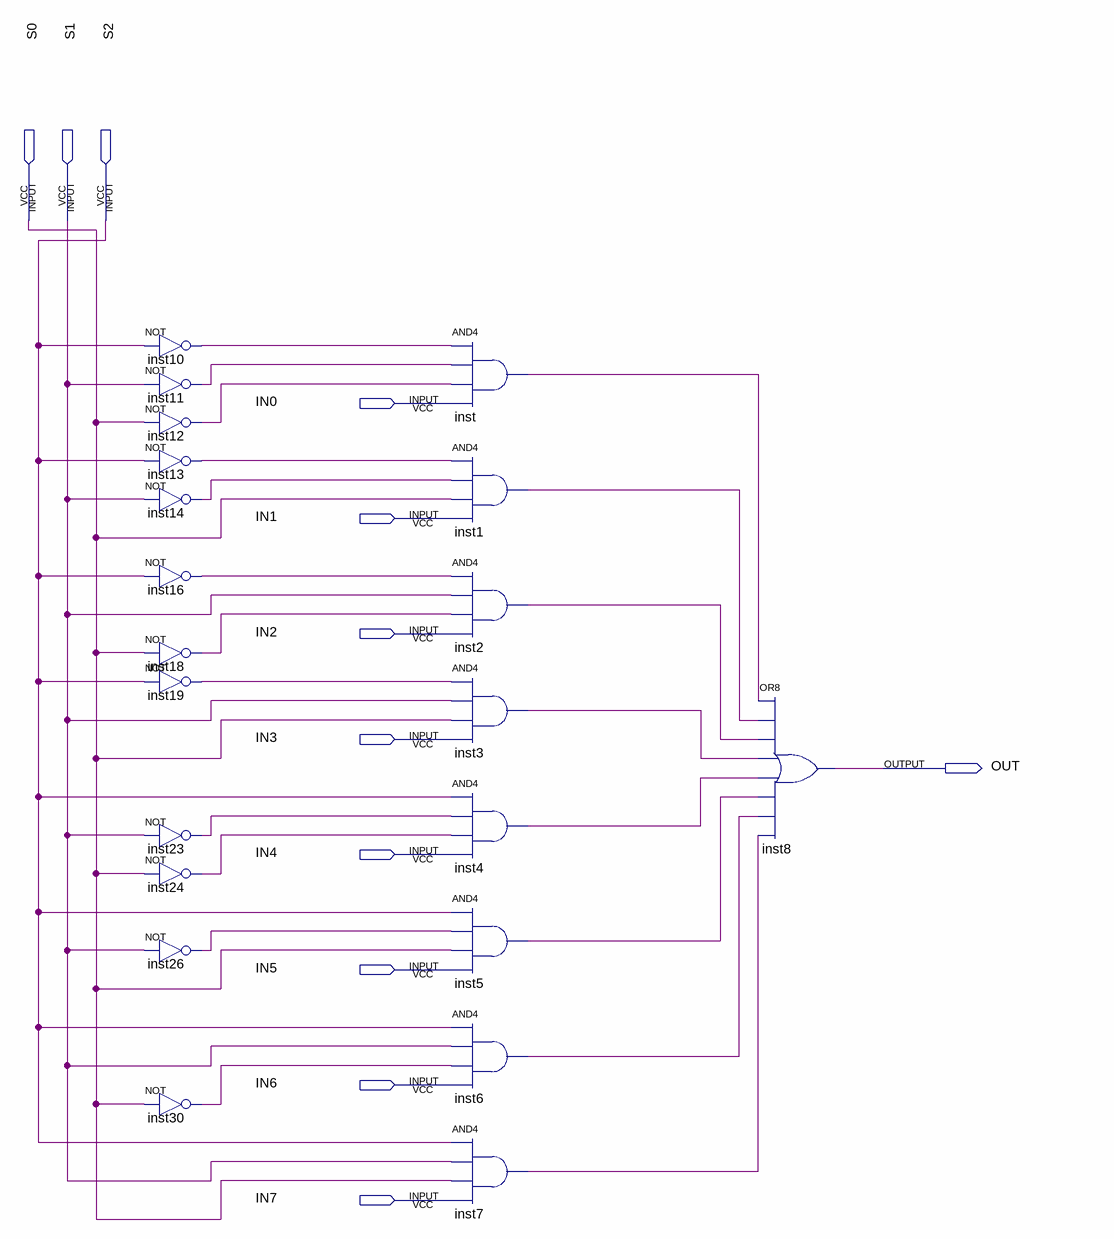
[diagram p0: schematic sheet]
// Quartus schematic MuxOitoPorUm.bdf as structural Verilog: 21 symbols, 12 pins
module MuxOitoPorUm (
  input  S0,
  input  S1,
  input  S2,
  input  IN0,
  input  IN1,
  input  IN2,
  input  IN3,
  input  IN4,
  input  IN5,
  input  IN6,
  input  IN7,
  output OUT
);

  wire inst1_out, inst2_out, inst3_out, inst4_out, inst5_out, inst6_out, inst7_out, inst10_out, inst11_out,
       inst12_out, inst13_out, inst14_out, inst16_out, inst18_out, inst19_out, inst23_out, inst24_out,
       inst26_out, inst30_out, inst_out;

  not inst10 (inst10_out, S2);
  not inst11 (inst11_out, S1);
  not inst12 (inst12_out, S0);
  not inst13 (inst13_out, S2);
  not inst14 (inst14_out, S1);
  not inst16 (inst16_out, S2);
  not inst18 (inst18_out, S0);
  not inst19 (inst19_out, S2);
  not inst23 (inst23_out, S1);
  not inst24 (inst24_out, S0);
  not inst26 (inst26_out, S1);
  not inst30 (inst30_out, S0);
  and inst (inst_out, inst10_out, inst11_out, inst12_out, IN0);
  and inst1 (inst1_out, inst13_out, inst14_out, S0, IN1);
  and inst2 (inst2_out, inst16_out, S1, inst18_out, IN2);
  and inst3 (inst3_out, inst19_out, S1, S0, IN3);
  and inst4 (inst4_out, S2, inst23_out, inst24_out, IN4);
  and inst5 (inst5_out, S2, inst26_out, S0, IN5);
  and inst6 (inst6_out, S2, S1, inst30_out, IN6);
  and inst7 (inst7_out, S2, S1, S0, IN7);
  or inst8 (OUT, inst_out, inst1_out, inst2_out, inst3_out, inst4_out, inst5_out, inst6_out, inst7_out);
endmodule
